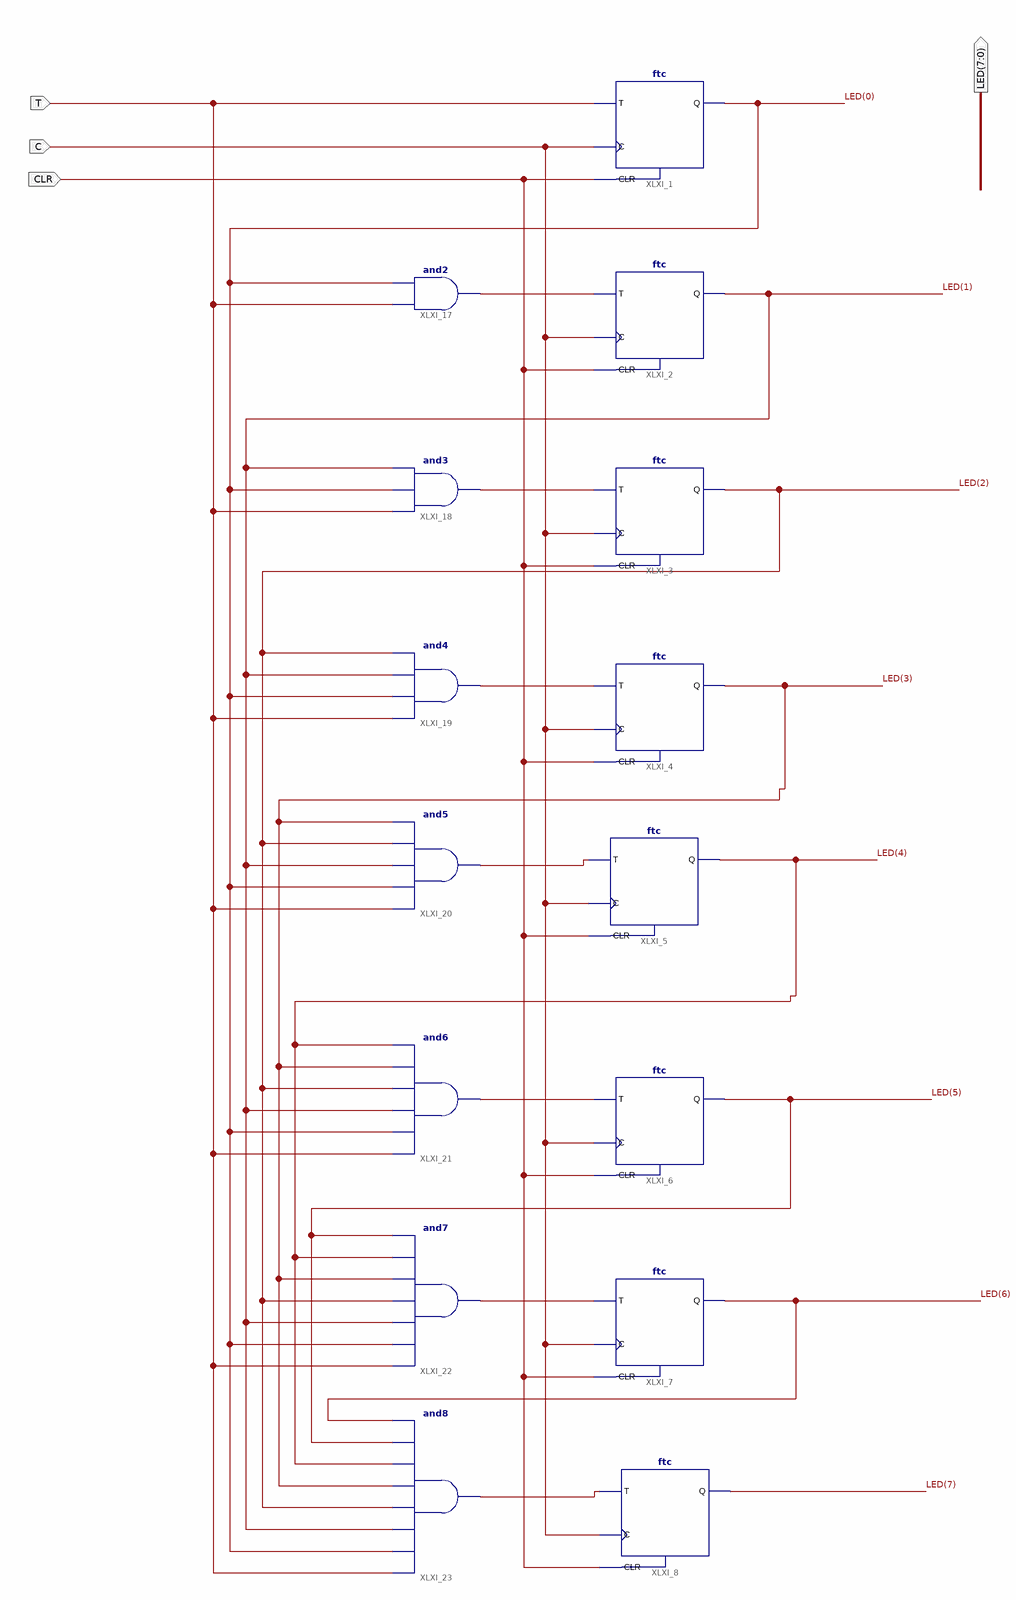
[diagram p0: schematic sheet 1]
// Xilinx ISE schematic lab7_4_8bitcnt.sch (spartan3) as structural Verilog: 15 symbols, 4 ports
module lab7_4_8bitcnt (
  input  CLR,
  input  C,
  input  T,
  output [7:0] LED
);

  wire XLXN_1, XLXN_2, XLXN_3, XLXN_4, XLXN_5, XLXN_6, XLXN_7;

  ftc XLXI_1 (.C(C), .CLR(CLR), .T(T), .Q(LED[0]));
  ftc XLXI_2 (.C(C), .CLR(CLR), .T(XLXN_1), .Q(LED[1]));
  ftc XLXI_3 (.C(C), .CLR(CLR), .T(XLXN_2), .Q(LED[2]));
  ftc XLXI_4 (.C(C), .CLR(CLR), .T(XLXN_3), .Q(LED[3]));
  ftc XLXI_5 (.C(C), .CLR(CLR), .T(XLXN_4), .Q(LED[4]));
  ftc XLXI_6 (.C(C), .CLR(CLR), .T(XLXN_5), .Q(LED[5]));
  ftc XLXI_7 (.C(C), .CLR(CLR), .T(XLXN_6), .Q(LED[6]));
  and XLXI_17 (XLXN_1, T, LED[0]);
  and XLXI_18 (XLXN_2, T, LED[0], LED[1]);
  and XLXI_19 (XLXN_3, T, LED[0], LED[1], LED[2]);
  and XLXI_20 (XLXN_4, T, LED[0], LED[1], LED[2], LED[3]);
  and XLXI_21 (XLXN_5, T, LED[0], LED[1], LED[2], LED[3], LED[4]);
  and XLXI_22 (XLXN_6, T, LED[0], LED[1], LED[2], LED[3], LED[4], LED[5]);
  ftc XLXI_8 (.C(C), .CLR(CLR), .T(XLXN_7), .Q(LED[7]));
  and XLXI_23 (XLXN_7, T, LED[0], LED[1], LED[2], LED[3], LED[4], LED[5], LED[6]);
endmodule
